# EAGLE design electrical_diagram (EAGLE 6.4)
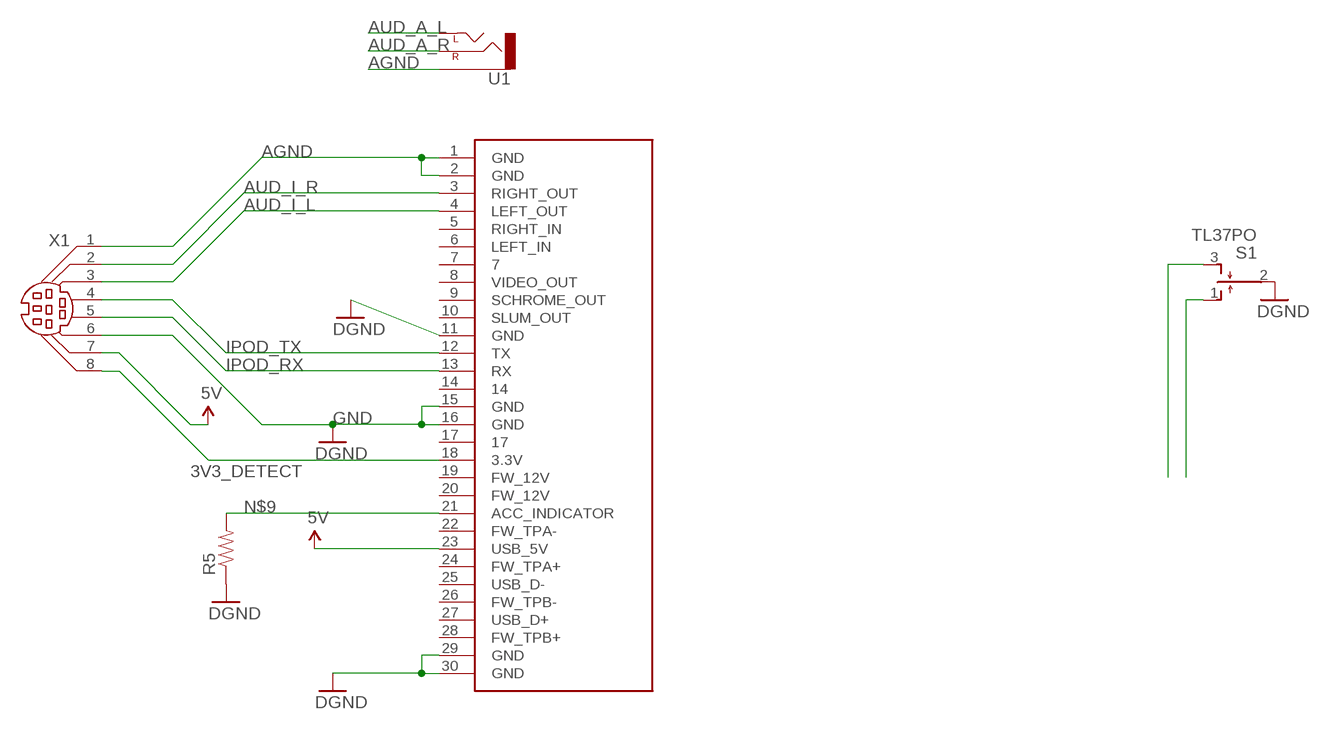
[diagram p0: schematic, sheet 1]

## Parts
R5  RESISTOR0805-RES  [0805]
S1  TL37PO  [TL3XPO]
U1  AUDIO-JACKSMD2  [AUDIO-JACK-3.5MM-SMD]
U$1  IPOD_CONNECTOR_MALE  [IPOD_MALE_CONNECTOR]
X1  MDIN08K  [MDIN08K]

## Nets
3V3_DETECT: U$1.18(3.3V) X1.8
5V: U$1.23(USB_5V) X1.7
AGND: U1.SLEEVE U$1.1(GND) U$1.2(GND) X1.1
AUD_A_L: U1.TIP(LEFT)
AUD_A_R: U1.RING(RIGHT)
AUD_I_L: U$1.4(LEFT_OUT) X1.3
AUD_I_R: U$1.3(RIGHT_OUT) X1.2
GND: R5.1 S1.2(P) U$1.11(GND) U$1.15(GND) U$1.16(GND) U$1.29(GND) U$1.30(GND) X1.6 ; supply symbol labelled DGND
IPOD_RX: U$1.13(RX) X1.5
IPOD_TX: U$1.12(TX) X1.4
N$1: S1.1(O)
N$2: S1.3(S)
N$9: R5.2 U$1.21(ACC_INDICATOR)
Unconnected: U$1.5(RIGHT_IN) U$1.6(LEFT_IN) U$1.7 U$1.8(VIDEO_OUT) U$1.9(SCHROME_OUT) U$1.10(SLUM_OUT) U$1.14 U$1.17 U$1.19(FW_12V) U$1.20(FW_12V) U$1.22(FW_TPA-) U$1.24(FW_TPA+) U$1.25(USB_D-) U$1.26(FW_TPB-) U$1.27(USB_D+) U$1.28(FW_TPB+)

## Library data of the parts
R5 = SparkFun-Resistors:RESISTOR: Resistor Basic schematic elements and footprints for 0603, 1206, and PTH resistors.
S1 = switch:TL37PO: TINY SWITCH MOM OFF MOM Source: http://www2.produktinfo.conrad.com/datenblaetter/700000-724999/705152-da-01-de-Subminiaturschalter_TL_36YO.pdf
U1 = SparkFun-Connectors:AUDIO-JACK: 3.5mm Audio Jack Simple 3.5mm common PCB mount audio jack. SKU: PRT-08032
U$1 = SparkFun-Connectors:IPOD_CONNECTOR_MALE: iPod Male Connector This is the connector that will insert into an iPods. Use this connector to gain access to the various iPod pins. Schematic and footprint are not yet production proven. The PCB thickness must be more thin than the standard 0.062" FR4. Spark Fun Electronics SKU : DEV-00633
X1 = con-yamaichi:MDIN08K: YAMAICHI CONNECTOR; OC_FARNELL: unknown; OC_NEWARK: unknown

## Board
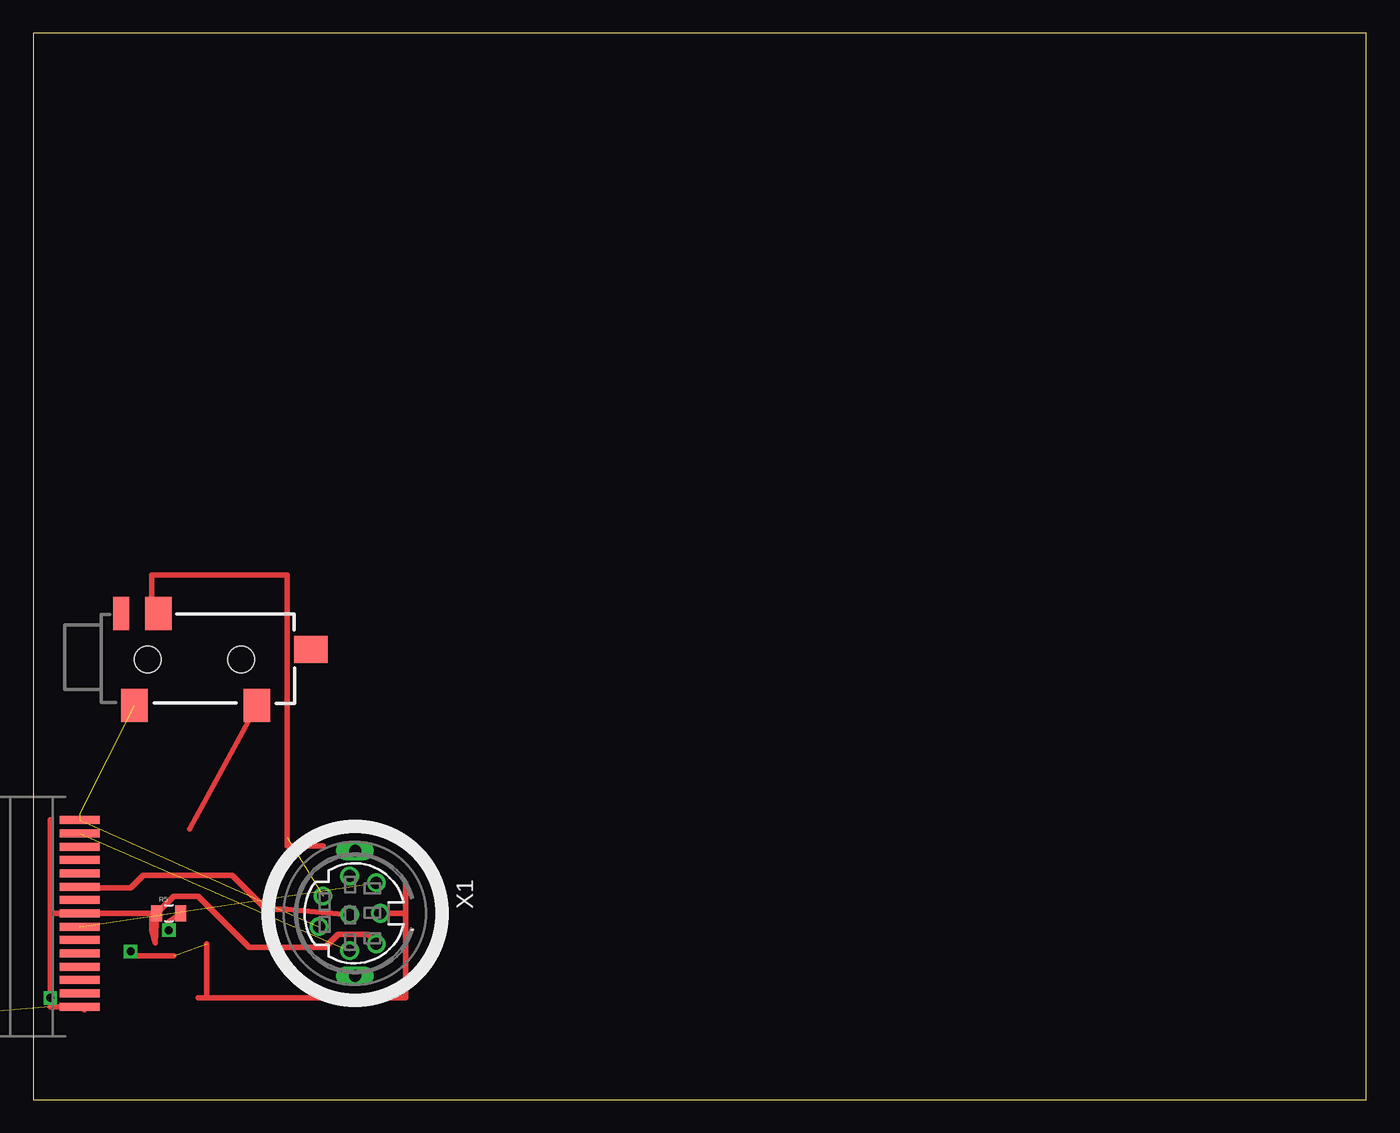
[diagram p1: board, top side]
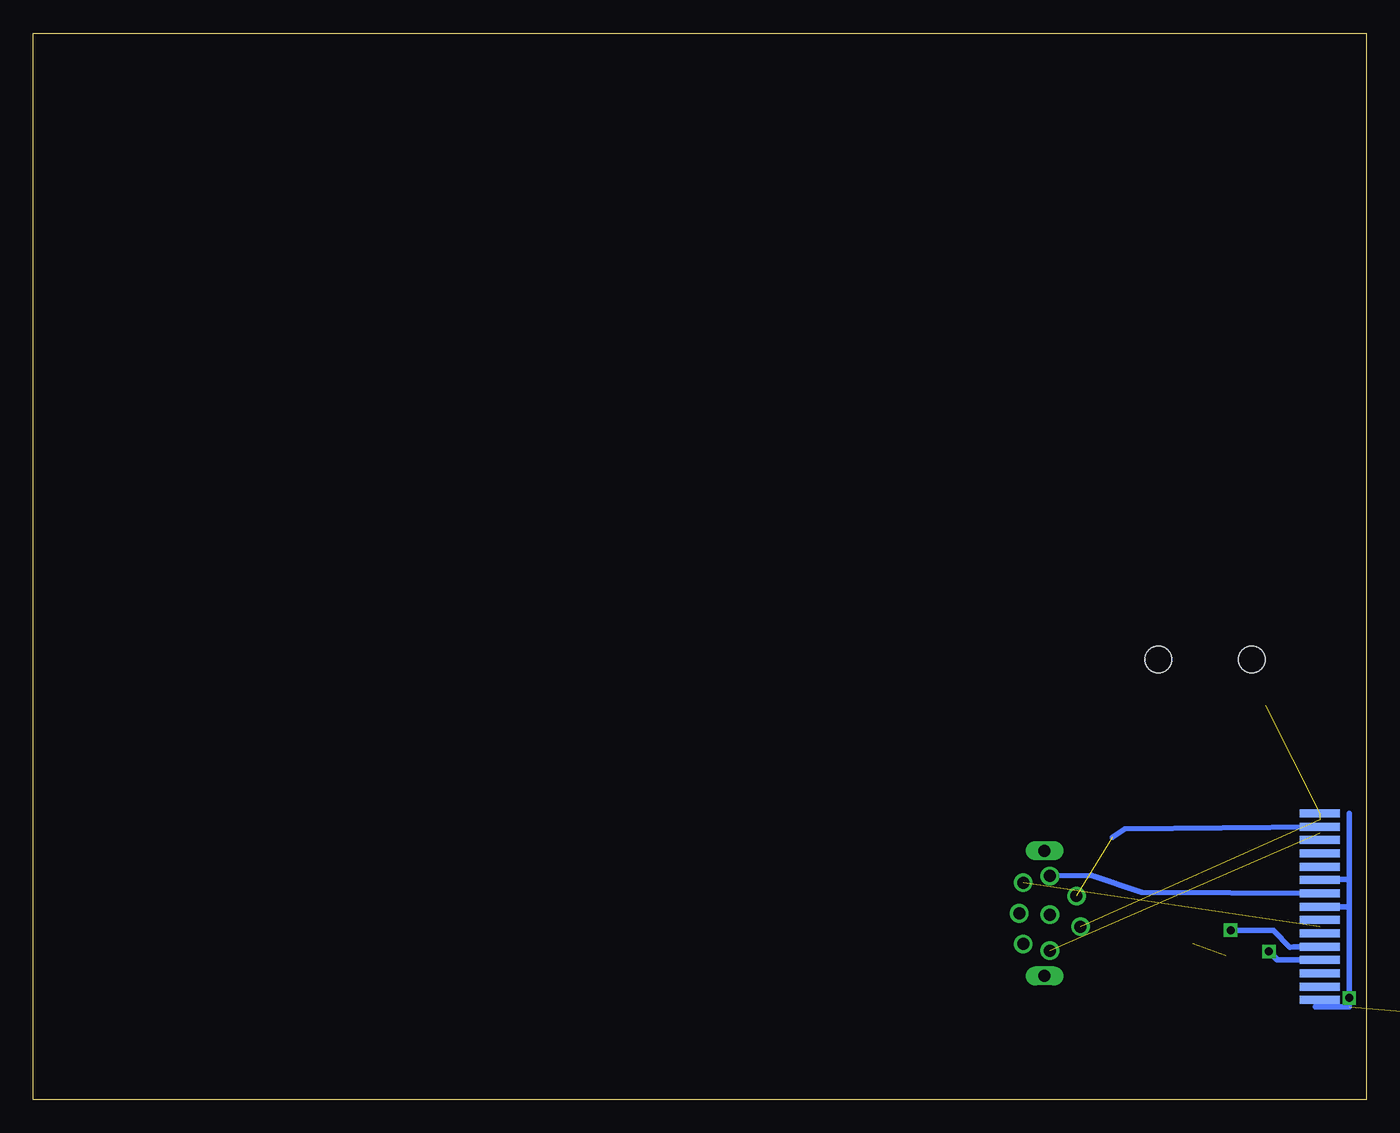
[diagram p2: board, bottom side, seen from below]

Size 100 x 80 mm. Coordinates in mm from the lower left corner, seen from the top.
Outline: 0,0 100,0 100,80 0,80 0,0
Copper layers (1*16): Top 0.035mm / dielectric 1.5mm / Bottom 0.035mm
Design rules "default": minimum track width 10mil, minimum drill 24mil, track to track 8mil, track to pad 8mil, pad to pad 8mil, via to via 8mil, smd to smd 8mil, copper to edge 40mil, drill to drill 8mil, minimum pad ring 10mil, minimum via ring 8mil, stop-mask expansion 4mil, vias tented up to drill 0mil, thermal gap 10mil

### Footprints (pad centres in the part's own frame; a part is rotated, then mirrored left to right if it is on the bottom)
0805 = smd 0.8 x 1.2: 1 -0.9,0; 2 0.9,0
TL3XPO = drill 1.1 pad 1.422 long: 1 -2.54,0; 2 0,0; 3 2.54,0
AUDIO-JACK-3.5MM-SMD = smd 2 x 2.5: RING 4.3,3.45; SLEEVE 2.5,-3.45; TIP 11.7,-3.45 | smd 1.2 x 2.5: RSH 1.5,3.45 | smd 2.5 x 2: TSH 15.75,0.75 | hole 2: 3.5,0; 10.5,0
IPOD_MALE_CONNECTOR = smd 0.6 x 3 bottom: 1 7.5,0; 3 6.5,0; 5 5.5,0; 7 4.5,0; 9 3.5,0; 11 2.5,0; 13 1.5,0; 15 0.5,0; 17 -0.5,0; 19 -1.5,0; 21 -2.5,0; 23 -3.5,0; 25 -4.5,0; 27 -5.5,0; 29 -6.5,0 | smd 0.6 x 3: 2 7,0; 4 6,0; 6 5,0; 8 4,0; 10 3,0; 12 2,0; 14 1,0; 16 0,0; 18 -1,0; 20 -2,0; 22 -3,0; 24 -4,0; 26 -5,0; 28 -6,0; 30 -7,0
MDIN08K = drill 0.9: 1 1,-2.7; 2 -1.3,-2.4; 3 2.8,-0.4; 4 0.1,-0.4; 5 -2.8,-0.4; 6 2.3,1.6; 7 0,1.9; 8 -2.3,1.6 | drill 0.9 long: M1 -4.7,0; M2 4.7,0

### Placement (x,y rotation side)
R5  10.16,13.97 0 top
S1  -13.34,5.71 0 top  (outside the outline)
U1  5.08,33.02 0 top
U$1  3.49,13.97 90 top
X1  24.13,13.97 270 top

### Tracks (layer width: path | path; a pad name or v marks a point on that pad's centre or on a via)
3V3_DETECT  (1 unrouted)
5V  (via drill 0.6)  (1 unrouted)
  Top 0.406: 27.94,16.27 27.94,13.97 | 27.94,13.97 27.94,7.62 13.02,7.62 | 12.38,7.62 13.02,7.62 | 13.02,7.62 13.02,11.7 | 10.53,10.79 7.62,10.79 v7.3,11.11 | X1.7 27.94,13.97
  Bottom 0.406: v7.3,11.11 6.66,10.47 U$1.23
AGND  (3 unrouted)
AUD_A_L
  Top 0.406: 11.75,20.32 U1.TIP
AUD_A_R
  Top 0.406: U1.RING 8.89,36.47 8.89,39.37 19.05,39.37 19.05,19.05 21.73,19.05
AUD_I_L  (1 unrouted)
AUD_I_R  (1 unrouted)
  Bottom 0.406: U$1.3 18.1,20.32 19.05,19.68
GND  (via drill 0.6)  (1 unrouted)
  Top 0.406: 1.27,13.97 v1.27,7.62 1.27,6.97 U$1.30 3.81,6.72 | 1.27,13.97 U$1.16 8.89,13.97 8.89,12.7 9.15,11.75 R5.1 10.53,15.24 12.38,15.24 16.19,11.43 21.91,11.43 22.86,12.38 25.08,12.38 25.73,11.73 X1.6 | 1.27,13.97 1.27,20.97
  Bottom 0.406: U$1.29 3.81,6.97 1.27,6.97 v1.27,7.62 1.27,14.47 | 1.27,14.47 1.27,16.51 | 1.27,16.51 3.81,16.51 U$1.11 | U$1.15 1.27,14.47 | 1.27,21.47 1.27,16.51
IPOD_RX
  Bottom 0.406: U$1.13 16.83,15.56 20.64,16.83 X1.5
IPOD_TX
  Top 0.406: U$1.12 3.9,15.88 7.3,15.88 8.26,16.83 14.92,16.83 17.46,14.29 19.05,14.29 X1.4
N$9  (via drill 0.6)
  Top 0.406: R5.2 10.16,13.34 v10.16,12.7
  Bottom 0.406: v10.16,12.7 6.99,12.7 5.71,11.43 5.44,11.47 U$1.21